# Altium schematic sheet VIDEOCONV_TC358870.SchDoc
size A4
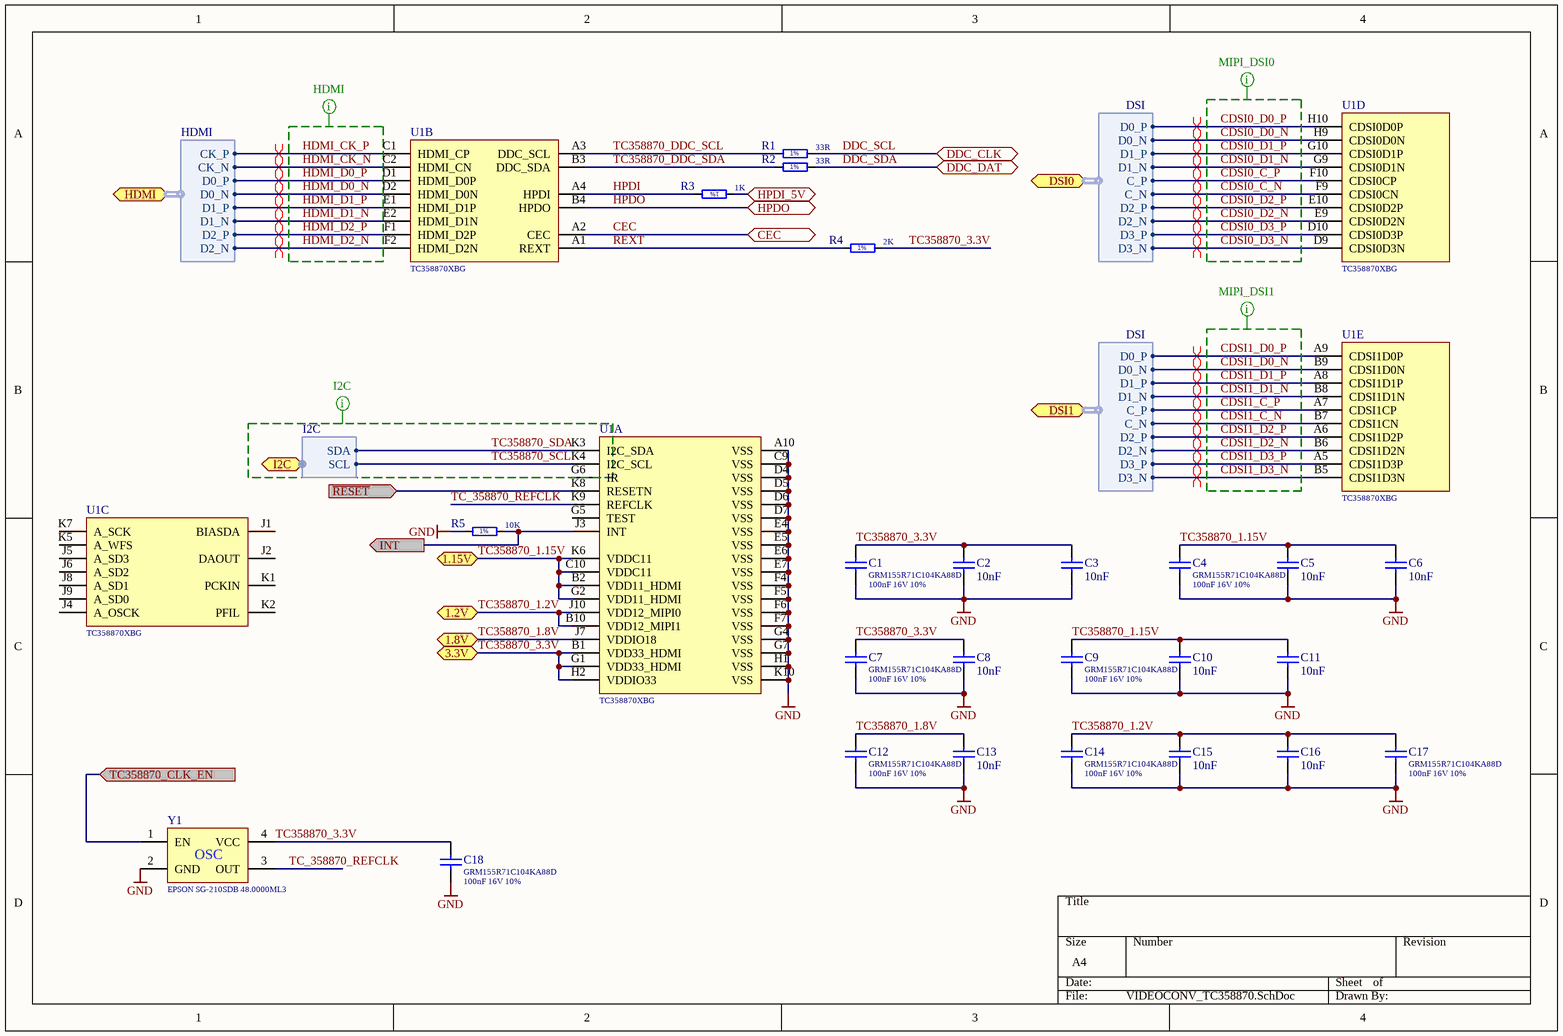
[diagram p0: VIDEOCONV_TC358870.SchDoc]

## Parts
C1  GRM155R71C104KA88D  value 100nF 16V 10%  [0402]
C2  10nF  [0402C]
C3  10nF  [0402C]
C4  GRM155R71C104KA88D  value 100nF 16V 10%  [0402]
C5  10nF  [0402C]
C6  10nF  [0402C]
C7  GRM155R71C104KA88D  value 100nF 16V 10%  [0402]
C8  10nF  [0402C]
C9  GRM155R71C104KA88D  value 100nF 16V 10%  [0402]
C10  10nF  [0402C]
C11  10nF  [0402C]
C12  GRM155R71C104KA88D  value 100nF 16V 10%  [0402]
C13  10nF  [0402C]
C14  GRM155R71C104KA88D  value 100nF 16V 10%  [0402]
C15  10nF  [0402C]
C16  10nF  [0402C]
C17  GRM155R71C104KA88D  value 100nF 16V 10%  [0402]
C18  GRM155R71C104KA88D  value 100nF 16V 10%  [0402]
R1  33R  [0402R]
R2  33R  [0402R]
R3  1K  [0402R]
R4  2K  [0402R]
R5  10K  [0402R]
U1  TC358870XBG  [VFBGA-80-0707-0.65]  (parts A,B,C,D,E of 5)
Y1  EPSON SG-210SDB 48.0000ML3  [2025]

## Ports
1.2V, 1.8V, 1.15V, 3.3V, CEC (bidir), DDC_CLK (bidir), DDC_DAT (bidir), DSI0 (harness DSI), DSI1 (harness DSI), HDMI (harness HDMI), HPDI_5V (bidir), HPDO (bidir), I2C (harness I2C), INT (out), TC358870_CLK_EN (in), ~{RESET} (in)

## Harnesses
HDMI: CK_N, CK_P, D0_N, D0_P, D1_N, D1_P, D2_N, D2_P
DSI: C_P, D0_N, D0_P, D1_N, D1_P, D2_N, D2_P, D3_N, D3_P, C_N
I2C: SDA, SCL

## Nets
GND: C1.2 C2.1 C3.1 C4.2 C5.1 C6.1 C7.2 C8.1 C9.2 C10.1 C11.1 C12.2 C13.1 C14.2 C15.1 C16.1 C17.2 C18.2 R5.1 U1.A10(VSS) U1.C9(VSS) U1.D4(VSS) U1.D5(VSS) U1.D6(VSS) U1.D7(VSS) U1.E4(VSS) U1.E5(VSS) U1.E6(VSS) U1.E7(VSS) U1.F4(VSS) U1.F5(VSS) U1.F6(VSS) U1.F7(VSS) U1.G4(VSS) U1.G7(VSS) U1.H1(VSS) U1.K10(VSS) Y1.2(GND)
CDSI0_C_N: U1.F9(CDSI0CN) ; port DSI0.C_N
CDSI0_C_P: U1.F10(CDSI0CP) ; port DSI0.C_P
CDSI0_D0_N: U1.H9(CDSI0D0N) ; port DSI0.D0_N
CDSI0_D0_P: U1.H10(CDSI0D0P) ; port DSI0.D0_P
CDSI0_D1_N: U1.G9(CDSI0D1N) ; port DSI0.D1_N
CDSI0_D1_P: U1.G10(CDSI0D1P) ; port DSI0.D1_P
CDSI0_D2_N: U1.E9(CDSI0D2N) ; port DSI0.D2_N
CDSI0_D2_P: U1.E10(CDSI0D2P) ; port DSI0.D2_P
CDSI0_D3_N: U1.D9(CDSI0D3N) ; port DSI0.D3_N
CDSI0_D3_P: U1.D10(CDSI0D3P) ; port DSI0.D3_P
CDSI1_C_N: U1.B7(CDSI1CN) ; port DSI1.C_N
CDSI1_C_P: U1.A7(CDSI1CP) ; port DSI1.C_P
CDSI1_D0_N: U1.B9(CDSI1D0N) ; port DSI1.D0_N
CDSI1_D0_P: U1.A9(CDSI1D0P) ; port DSI1.D0_P
CDSI1_D1_N: U1.B8(CDSI1D1N) ; port DSI1.D1_N
CDSI1_D1_P: U1.A8(CDSI1D1P) ; port DSI1.D1_P
CDSI1_D2_N: U1.B6(CDSI1D2N) ; port DSI1.D2_N
CDSI1_D2_P: U1.A6(CDSI1D2P) ; port DSI1.D2_P
CDSI1_D3_N: U1.B5(CDSI1D3N) ; port DSI1.D3_N
CDSI1_D3_P: U1.A5(CDSI1D3P) ; port DSI1.D3_P
CEC: U1.A2(CEC) ; port CEC
DDC_SCL: R1.2 ; port DDC_CLK
DDC_SDA: R2.2 ; port DDC_DAT
HDMI_CK_N: U1.C2(HDMI_CN) ; port HDMI.CK_N
HDMI_CK_P: U1.C1(HDMI_CP) ; port HDMI.CK_P
HDMI_D0_N: U1.D2(HDMI_D0N) ; port HDMI.D0_N
HDMI_D0_P: U1.D1(HDMI_D0P) ; port HDMI.D0_P
HDMI_D1_N: U1.E2(HDMI_D1N) ; port HDMI.D1_N
HDMI_D1_P: U1.E1(HDMI_D1P) ; port HDMI.D1_P
HDMI_D2_N: U1.F2(HDMI_D2N) ; port HDMI.D2_N
HDMI_D2_P: U1.F1(HDMI_D2P) ; port HDMI.D2_P
HPDI: R3.2 U1.A4(HPDI)
HPDI_5V: R3.1 ; port HPDI_5V
HPDO: U1.B4(HPDO) ; port HPDO
INT: R5.2 U1.J3(INT) ; port INT
~{RESET}: U1.K8(RESETN) ; port ~{RESET}
REXT: R4.1 U1.A1(REXT)
TC358870_1.2V: C14.1 C15.2 C16.2 C17.1 U1.B10(VDD12_MIPI1) U1.J10(VDD12_MIPI0) ; port 1.2V
TC358870_1.8V: C12.1 C13.2 U1.J7(VDDIO18) ; port 1.8V
TC358870_1.15V: C4.1 C5.2 C6.2 C9.1 C10.2 C11.2 U1.B2(VDD11_HDMI) U1.C10(VDDC11) U1.G2(VDD11_HDMI) U1.K6(VDDC11) ; port 1.15V
TC358870_3.3V: C1.1 C2.2 C3.2 C7.1 C8.2 C18.1 R4.2 U1.B1(VDD33_HDMI) U1.G1(VDD33_HDMI) U1.H2(VDDIO33) Y1.4(VCC) ; port 3.3V
TC358870_CLK_EN: Y1.1(EN) ; port TC358870_CLK_EN
TC358870_DDC_SCL: R1.1 U1.A3(DDC_SCL)
TC358870_DDC_SDA: R2.1 U1.B3(DDC_SDA)
TC358870_SCL: U1.K4(I2C_SCL) ; port I2C.SCL
TC358870_SDA: U1.K3(I2C_SDA) ; port I2C.SDA
TC_358870_REFCLK: U1.K9(REFCLK) Y1.3(OUT)

Not connected (* = marked no-connect by the designer): U1 G5(TEST) G6(IR) J1(BIASDA) J2(DAOUT) J4(A_OSCK) J5(A_SD3) J6(A_SD2) J8(A_SD1) J9(A_SD0) K1(PCKIN) K2(PFIL) K5(A_WFS) K7(A_SCK)

## Layout directives
differential pair: CDSI0_C_N, CDSI0_C_P, CDSI0_D0_N, CDSI0_D0_P, CDSI0_D1_N, CDSI0_D1_P, CDSI0_D2_N, CDSI0_D2_P, CDSI0_D3_N, CDSI0_D3_P, CDSI1_C_N, CDSI1_C_P, CDSI1_D0_N, CDSI1_D0_P, CDSI1_D1_N, CDSI1_D1_P, CDSI1_D2_N, CDSI1_D2_P, CDSI1_D3_N, CDSI1_D3_P, HDMI_CK_N, HDMI_CK_P, HDMI_D0_N, HDMI_D0_P, HDMI_D1_N, HDMI_D1_P, HDMI_D2_N, HDMI_D2_P
net class MIPI_DSI0; rule Matched Net Lengths [Tolerance = 0.15mm]; rule Matched Net Lengths [Tolerance = 1.5mm]; rule Length Constraint [Min Length = 0mm    Max Length = 200mm]; rule Maximum Via Count Constraint [Max Count = 2]; rule Impedance Constraint [Min = 76.50    Max = 103.0    ]: CDSI0_C_N, CDSI0_C_P, CDSI0_D0_N, CDSI0_D0_P, CDSI0_D1_N, CDSI0_D1_P, CDSI0_D2_N, CDSI0_D2_P, CDSI0_D3_N, CDSI0_D3_P
net class HDMI; rule Impedance Constraint [Min = 77.00    Max = 103.0    ]; rule Matched Net Lengths [Tolerance = 22mm]; rule Matched Net Lengths [Tolerance = 0.75mm]: HDMI_CK_N, HDMI_CK_P, HDMI_D0_N, HDMI_D0_P, HDMI_D1_N, HDMI_D1_P, HDMI_D2_N, HDMI_D2_P
net class MIPI_DSI1; rule Matched Net Lengths [Tolerance = 0.15mm]; rule Matched Net Lengths [Tolerance = 1.5mm]; rule Length Constraint [Min Length = 0mm    Max Length = 200mm]; rule Maximum Via Count Constraint [Max Count = 2]; rule Impedance Constraint [Min = 76.50    Max = 103.0    ]: CDSI1_C_N, CDSI1_C_P, CDSI1_D0_N, CDSI1_D0_P, CDSI1_D1_N, CDSI1_D1_P, CDSI1_D2_N, CDSI1_D2_P, CDSI1_D3_N, CDSI1_D3_P
net class I2C: TC358870_SCL, TC358870_SDA

## Notes on the sheet
- (in symbol Oscillator) OSC

## Library data of the parts
C1 C4 C7 C9 C12 C14 C17 C18 = Capacitor ceramic: Ceramic capacitor; Voltage: 16V; Tolerance: 10%; Capacitance: 100nF
C2 C3 C5 C6 C8 C10 C11 C13 C15 C16 = Capacitor ceramic: Ceramic capacitor; Tolerance: 10%; Voltage: 50V; Value: 10nF
R1-R5 = Resistor 1%: Thin Film Chip Resistor; Power: 0.1 W; Tolerance: 1%
  R1 R2: Value: 33R
  R3: Value: 1K
  R4: Value: 2K
  R5: Value: 10K
U1 = TC358870XBG: Ultra HD to dual DSI bridge
Y1 = Oscillator: Value: EPSON SG-210SDB 48.0000ML3; Datasheet: https://support.epson.biz/td/api/doc_check.php?dl=brief_SG-210SGB_en.pdf; Supplier: http://www.digikey.com/product-detail/en/epson/SG-210SDB-48.0000ML3/SER3706CT-ND/2403479; Price(1): 1.66; Price(100): 1.32